# EAGLE schematic 4bitCounter (EAGLE 9.6.2)
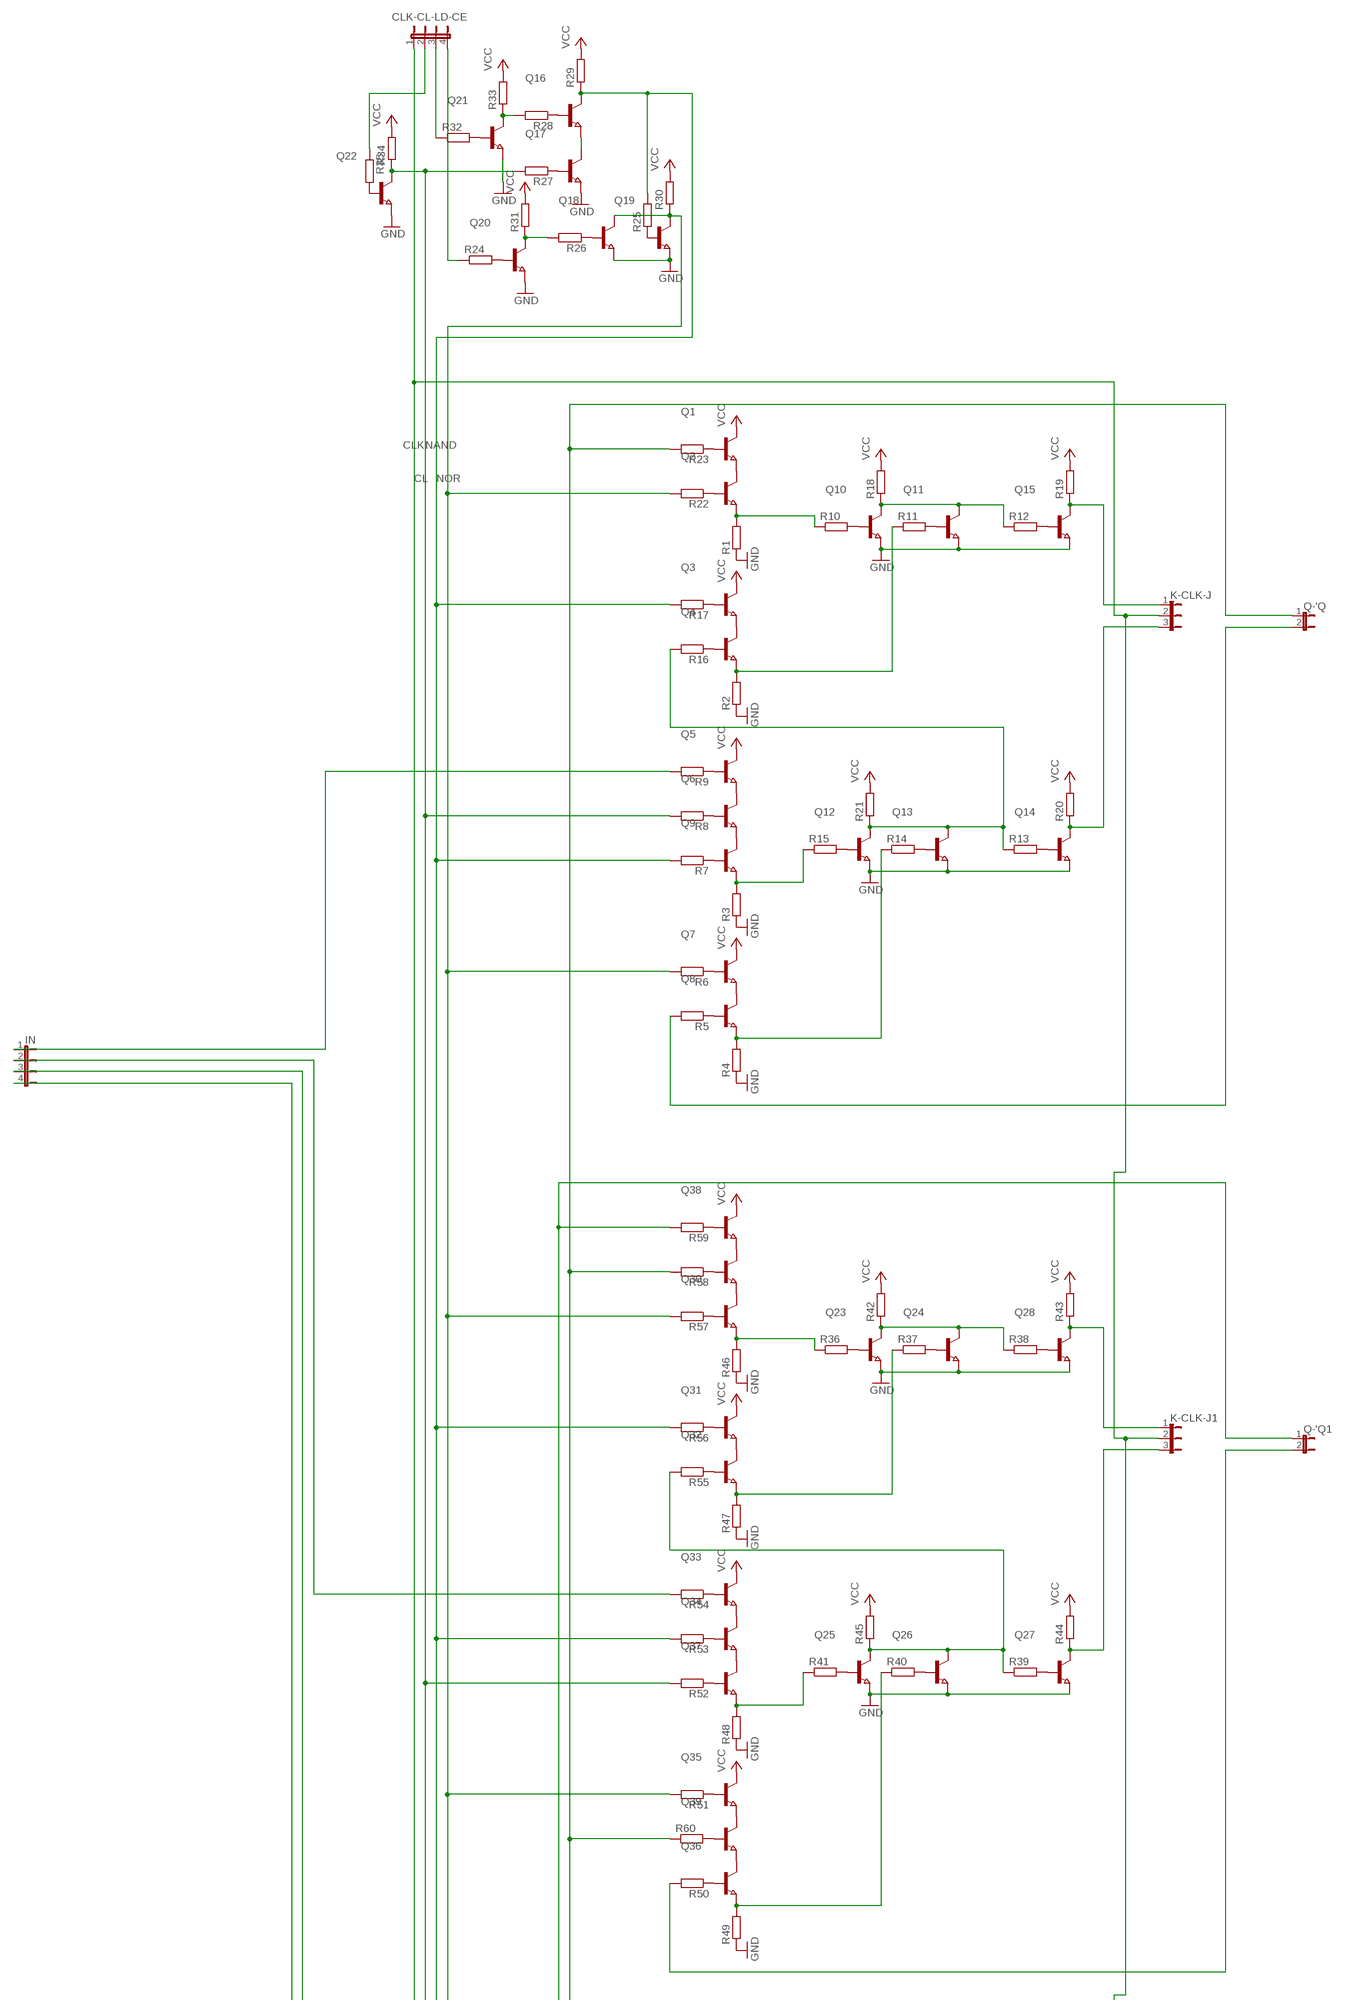
[diagram p0: schematic, sheet 1, part 1 of 2]
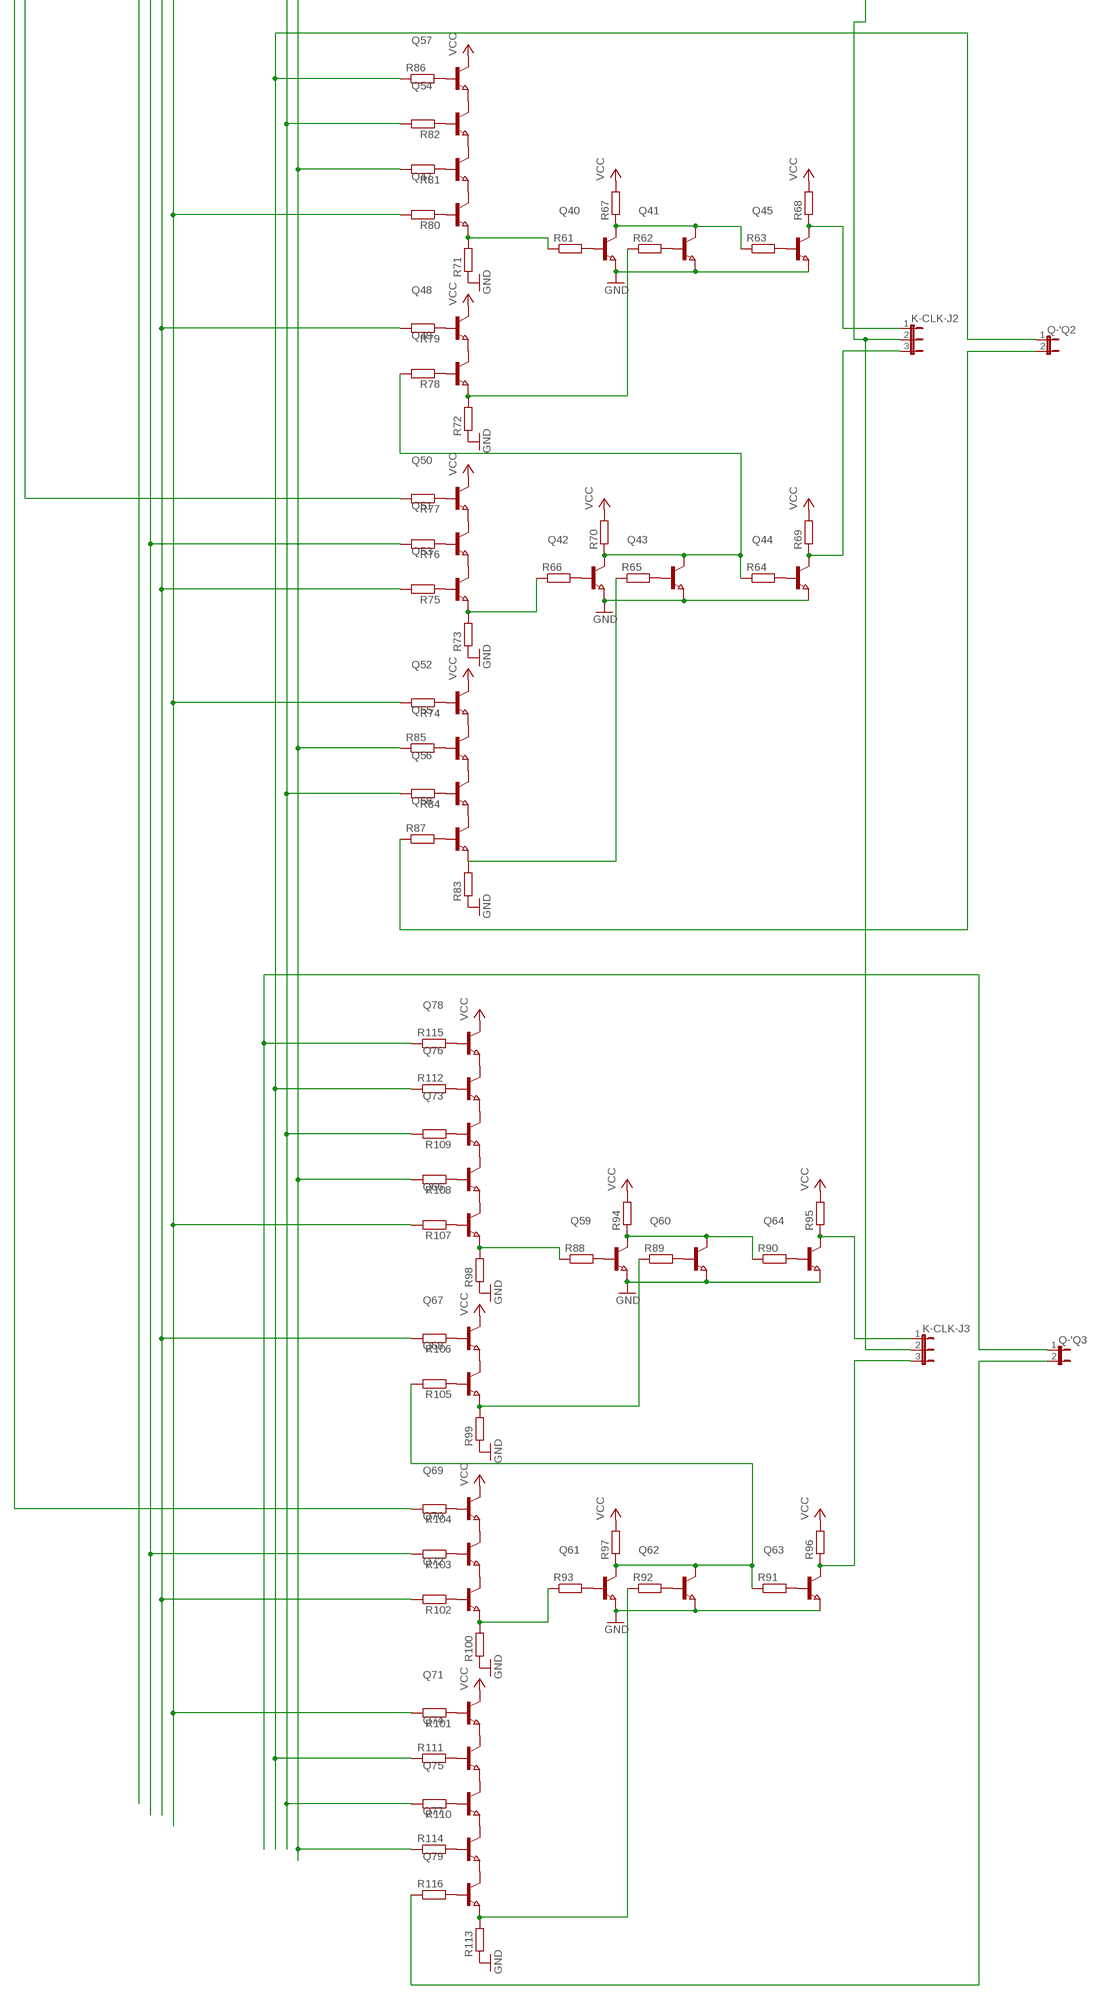
[diagram p1: schematic, sheet 1, part 2 of 2]

## Parts
CLK-CL-LD-CE  JP4E  [JP4]
IN  JP4E  [JP4]
K-CLK-J  JP2E  [JP2]
K-CLK-J1  JP2E  [JP2]
K-CLK-J2  JP2E  [JP2]
K-CLK-J3  JP2E  [JP2]
Q1  NPN-TRANSISTOR_SOT23  [SOT23]
Q2  NPN-TRANSISTOR_SOT23  [SOT23]
Q3  NPN-TRANSISTOR_SOT23  [SOT23]
Q4  NPN-TRANSISTOR_SOT23  [SOT23]
Q5  NPN-TRANSISTOR_SOT23  [SOT23]
Q6  NPN-TRANSISTOR_SOT23  [SOT23]
Q7  NPN-TRANSISTOR_SOT23  [SOT23]
Q8  NPN-TRANSISTOR_SOT23  [SOT23]
Q9  NPN-TRANSISTOR_SOT23  [SOT23]
Q10  NPN-TRANSISTOR_SOT23  [SOT23]
Q11  NPN-TRANSISTOR_SOT23  [SOT23]
Q12  NPN-TRANSISTOR_SOT23  [SOT23]
Q13  NPN-TRANSISTOR_SOT23  [SOT23]
Q14  NPN-TRANSISTOR_SOT23  [SOT23]
Q15  NPN-TRANSISTOR_SOT23  [SOT23]
Q16  NPN-TRANSISTOR_SOT23  [SOT23]
Q17  NPN-TRANSISTOR_SOT23  [SOT23]
Q18  NPN-TRANSISTOR_SOT23  [SOT23]
Q19  NPN-TRANSISTOR_SOT23  [SOT23]
Q20  NPN-TRANSISTOR_SOT23  [SOT23]
Q21  NPN-TRANSISTOR_SOT23  [SOT23]
Q22  NPN-TRANSISTOR_SOT23  [SOT23]
Q23  NPN-TRANSISTOR_SOT23  [SOT23]
Q24  NPN-TRANSISTOR_SOT23  [SOT23]
Q25  NPN-TRANSISTOR_SOT23  [SOT23]
Q26  NPN-TRANSISTOR_SOT23  [SOT23]
Q27  NPN-TRANSISTOR_SOT23  [SOT23]
Q28  NPN-TRANSISTOR_SOT23  [SOT23]
Q29  NPN-TRANSISTOR_SOT23  [SOT23]
Q30  NPN-TRANSISTOR_SOT23  [SOT23]
Q31  NPN-TRANSISTOR_SOT23  [SOT23]
Q32  NPN-TRANSISTOR_SOT23  [SOT23]
Q33  NPN-TRANSISTOR_SOT23  [SOT23]
Q34  NPN-TRANSISTOR_SOT23  [SOT23]
Q35  NPN-TRANSISTOR_SOT23  [SOT23]
Q36  NPN-TRANSISTOR_SOT23  [SOT23]
Q37  NPN-TRANSISTOR_SOT23  [SOT23]
Q38  NPN-TRANSISTOR_SOT23  [SOT23]
Q39  NPN-TRANSISTOR_SOT23  [SOT23]
Q40  NPN-TRANSISTOR_SOT23  [SOT23]
Q41  NPN-TRANSISTOR_SOT23  [SOT23]
Q42  NPN-TRANSISTOR_SOT23  [SOT23]
Q43  NPN-TRANSISTOR_SOT23  [SOT23]
Q44  NPN-TRANSISTOR_SOT23  [SOT23]
Q45  NPN-TRANSISTOR_SOT23  [SOT23]
Q46  NPN-TRANSISTOR_SOT23  [SOT23]
Q47  NPN-TRANSISTOR_SOT23  [SOT23]
Q48  NPN-TRANSISTOR_SOT23  [SOT23]
Q49  NPN-TRANSISTOR_SOT23  [SOT23]
Q50  NPN-TRANSISTOR_SOT23  [SOT23]
Q51  NPN-TRANSISTOR_SOT23  [SOT23]
Q52  NPN-TRANSISTOR_SOT23  [SOT23]
Q53  NPN-TRANSISTOR_SOT23  [SOT23]
Q54  NPN-TRANSISTOR_SOT23  [SOT23]
Q55  NPN-TRANSISTOR_SOT23  [SOT23]
Q56  NPN-TRANSISTOR_SOT23  [SOT23]
Q57  NPN-TRANSISTOR_SOT23  [SOT23]
Q58  NPN-TRANSISTOR_SOT23  [SOT23]
Q59  NPN-TRANSISTOR_SOT23  [SOT23]
Q60  NPN-TRANSISTOR_SOT23  [SOT23]
Q61  NPN-TRANSISTOR_SOT23  [SOT23]
Q62  NPN-TRANSISTOR_SOT23  [SOT23]
Q63  NPN-TRANSISTOR_SOT23  [SOT23]
Q64  NPN-TRANSISTOR_SOT23  [SOT23]
Q65  NPN-TRANSISTOR_SOT23  [SOT23]
Q66  NPN-TRANSISTOR_SOT23  [SOT23]
Q67  NPN-TRANSISTOR_SOT23  [SOT23]
Q68  NPN-TRANSISTOR_SOT23  [SOT23]
Q69  NPN-TRANSISTOR_SOT23  [SOT23]
Q70  NPN-TRANSISTOR_SOT23  [SOT23]
Q71  NPN-TRANSISTOR_SOT23  [SOT23]
Q72  NPN-TRANSISTOR_SOT23  [SOT23]
Q73  NPN-TRANSISTOR_SOT23  [SOT23]
Q74  NPN-TRANSISTOR_SOT23  [SOT23]
Q75  NPN-TRANSISTOR_SOT23  [SOT23]
Q76  NPN-TRANSISTOR_SOT23  [SOT23]
Q77  NPN-TRANSISTOR_SOT23  [SOT23]
Q78  NPN-TRANSISTOR_SOT23  [SOT23]
Q79  NPN-TRANSISTOR_SOT23  [SOT23]
Q-'Q  JP1E  [JP1]
Q-'Q1  JP1E  [JP1]
Q-'Q2  JP1E  [JP1]
Q-'Q3  JP1E  [JP1]
R1  R-EU_R1206  [R1206]
R2  R-EU_R1206  [R1206]
R3  R-EU_R1206  [R1206]
R4  R-EU_R1206  [R1206]
R5  R-EU_R1206  [R1206]
R6  R-EU_R1206  [R1206]
R7  R-EU_R1206  [R1206]
R8  R-EU_R1206  [R1206]
R9  R-EU_R1206  [R1206]
R10  R-EU_R1206  [R1206]
R11  R-EU_R1206  [R1206]
R12  R-EU_R1206  [R1206]
R13  R-EU_R1206  [R1206]
R14  R-EU_R1206  [R1206]
R15  R-EU_R1206  [R1206]
R16  R-EU_R1206  [R1206]
R17  R-EU_R1206  [R1206]
R18  R-EU_R1206  [R1206]
R19  R-EU_R1206  [R1206]
R20  R-EU_R1206  [R1206]
R21  R-EU_R1206  [R1206]
R22  R-EU_R1206  [R1206]
R23  R-EU_R1206  [R1206]
R24  R-EU_R1206  [R1206]
R25  R-EU_R1206  [R1206]
R26  R-EU_R1206  [R1206]
R27  R-EU_R1206  [R1206]
R28  R-EU_R1206  [R1206]
R29  R-EU_R1206  [R1206]
R30  R-EU_R1206  [R1206]
R31  R-EU_R1206  [R1206]
R32  R-EU_R1206  [R1206]
R33  R-EU_R1206  [R1206]
R34  R-EU_R1206  [R1206]
R35  R-EU_R1206  [R1206]
R36  R-EU_R1206  [R1206]
R37  R-EU_R1206  [R1206]
R38  R-EU_R1206  [R1206]
R39  R-EU_R1206  [R1206]
R40  R-EU_R1206  [R1206]
R41  R-EU_R1206  [R1206]
R42  R-EU_R1206  [R1206]
R43  R-EU_R1206  [R1206]
R44  R-EU_R1206  [R1206]
R45  R-EU_R1206  [R1206]
R46  R-EU_R1206  [R1206]
R47  R-EU_R1206  [R1206]
R48  R-EU_R1206  [R1206]
R49  R-EU_R1206  [R1206]
R50  R-EU_R1206  [R1206]
R51  R-EU_R1206  [R1206]
R52  R-EU_R1206  [R1206]
R53  R-EU_R1206  [R1206]
R54  R-EU_R1206  [R1206]
R55  R-EU_R1206  [R1206]
R56  R-EU_R1206  [R1206]
R57  R-EU_R1206  [R1206]
R58  R-EU_R1206  [R1206]
R59  R-EU_R1206  [R1206]
R60  R-EU_R1206  [R1206]
R61  R-EU_R1206  [R1206]
R62  R-EU_R1206  [R1206]
R63  R-EU_R1206  [R1206]
R64  R-EU_R1206  [R1206]
R65  R-EU_R1206  [R1206]
R66  R-EU_R1206  [R1206]
R67  R-EU_R1206  [R1206]
R68  R-EU_R1206  [R1206]
R69  R-EU_R1206  [R1206]
R70  R-EU_R1206  [R1206]
R71  R-EU_R1206  [R1206]
R72  R-EU_R1206  [R1206]
R73  R-EU_R1206  [R1206]
R74  R-EU_R1206  [R1206]
R75  R-EU_R1206  [R1206]
R76  R-EU_R1206  [R1206]
R77  R-EU_R1206  [R1206]
R78  R-EU_R1206  [R1206]
R79  R-EU_R1206  [R1206]
R80  R-EU_R1206  [R1206]
R81  R-EU_R1206  [R1206]
R82  R-EU_R1206  [R1206]
R83  R-EU_R1206  [R1206]
R84  R-EU_R1206  [R1206]
R85  R-EU_R1206  [R1206]
R86  R-EU_R1206  [R1206]
R87  R-EU_R1206  [R1206]
R88  R-EU_R1206  [R1206]
R89  R-EU_R1206  [R1206]
R90  R-EU_R1206  [R1206]
R91  R-EU_R1206  [R1206]
R92  R-EU_R1206  [R1206]
R93  R-EU_R1206  [R1206]
R94  R-EU_R1206  [R1206]
R95  R-EU_R1206  [R1206]
R96  R-EU_R1206  [R1206]
R97  R-EU_R1206  [R1206]
R98  R-EU_R1206  [R1206]
R99  R-EU_R1206  [R1206]
R100  R-EU_R1206  [R1206]
R101  R-EU_R1206  [R1206]
R102  R-EU_R1206  [R1206]
R103  R-EU_R1206  [R1206]
R104  R-EU_R1206  [R1206]
R105  R-EU_R1206  [R1206]
R106  R-EU_R1206  [R1206]
R107  R-EU_R1206  [R1206]
R108  R-EU_R1206  [R1206]
R109  R-EU_R1206  [R1206]
R110  R-EU_R1206  [R1206]
R111  R-EU_R1206  [R1206]
R112  R-EU_R1206  [R1206]
R113  R-EU_R1206  [R1206]
R114  R-EU_R1206  [R1206]
R115  R-EU_R1206  [R1206]
R116  R-EU_R1206  [R1206]

## Nets
CL: Q22.3(C) R8.2 R27.2 R34.1 R52.2 R76.2 R103.2
CLK: CLK-CL-LD-CE.1 K-CLK-J1.2 K-CLK-J2.2 K-CLK-J3.2 K-CLK-J.2
GND: Q10.2(E) Q11.2(E) Q12.2(E) Q13.2(E) Q14.2(E) Q15.2(E) Q17.2(E) Q18.2(E) Q19.2(E) Q20.2(E) Q21.2(E) Q22.2(E) Q23.2(E) Q24.2(E) Q25.2(E) Q26.2(E) Q27.2(E) Q28.2(E) Q40.2(E) Q41.2(E) Q42.2(E) Q43.2(E) Q44.2(E) Q45.2(E) Q59.2(E) Q60.2(E) Q61.2(E) Q62.2(E) Q63.2(E) Q64.2(E) R1.1 R2.1 R3.1 R4.1 R46.1 R47.1 R48.1 R49.1 R71.1 R72.1 R73.1 R83.1 R98.1 R99.1 R100.1 R113.1
N$1: Q1.2(E) Q2.3(C)
N$2: Q3.2(E) Q4.3(C)
N$3: Q5.2(E) Q6.3(C)
N$4: Q7.2(E) Q8.3(C)
N$5: Q6.2(E) Q9.3(C)
N$6: Q2.2(E) R1.2 R10.1
N$7: Q4.2(E) R2.2 R11.1
N$8: Q9.2(E) R3.2 R15.1
N$9: Q8.2(E) R4.2 R14.1
N$10: Q8.1(B) R5.1
N$11: Q7.1(B) R6.1
N$12: Q9.1(B) R7.1
N$13: Q6.1(B) R8.1
N$14: Q5.1(B) R9.1
N$15: Q10.1(B) R10.2
N$16: Q11.1(B) R11.2
N$17: Q15.1(B) R12.2
N$18: Q14.1(B) R13.2
N$19: Q13.1(B) R14.2
N$20: Q12.1(B) R15.2
N$21: Q4.1(B) R16.1
N$22: Q3.1(B) R17.1
N$23: Q10.3(C) Q11.3(C) R12.1 R18.1
N$24: K-CLK-J.1 Q15.3(C) R19.1
N$25: K-CLK-J.3 Q14.3(C) R20.1
N$26: Q12.3(C) Q13.3(C) R13.1 R16.2 R21.1
N$27: Q2.1(B) R22.1
N$28: Q1.1(B) R23.1
N$29: IN.1 R9.2
N$30: Q16.2(E) Q17.3(C)
N$31: Q20.1(B) R24.2
N$32: Q19.1(B) R25.1
N$33: Q18.1(B) R26.1
N$34: Q17.1(B) R27.1
N$35: Q16.1(B) R28.1
N$36: Q-'Q.2 R5.2
N$37: Q23.1(B) R36.2
N$38: Q20.3(C) R26.2 R31.1
N$39: CLK-CL-LD-CE.4 R24.1
N$40: Q21.1(B) R32.2
N$41: Q21.3(C) R28.2 R33.1
N$42: CLK-CL-LD-CE.3 R32.1
N$43: Q22.1(B) R35.2
N$44: CLK-CL-LD-CE.2 R35.1
N$45: Q-'Q.1 R23.2 R58.2 R60.1 R81.2 R85.1 R108.2 R114.1
N$46: Q24.1(B) R37.2
N$47: Q28.1(B) R38.2
N$48: Q27.1(B) R39.2
N$49: Q26.1(B) R40.2
N$50: Q25.1(B) R41.2
N$51: Q23.3(C) Q24.3(C) R38.1 R42.1
N$52: K-CLK-J1.1 Q28.3(C) R43.1
N$53: K-CLK-J1.3 Q27.3(C) R44.1
N$54: Q25.3(C) Q26.3(C) R39.1 R45.1 R55.2
N$55: Q29.2(E) Q30.3(C)
N$56: Q31.2(E) Q32.3(C)
N$57: Q33.2(E) Q34.3(C)
N$58: IN.2 R54.2
N$59: Q34.2(E) Q37.3(C)
N$60: Q30.2(E) R36.1 R46.2
N$61: Q32.2(E) R37.1 R47.2
N$62: Q37.2(E) R41.1 R48.2
N$63: Q36.2(E) R40.1 R49.2
N$64: Q36.1(B) R50.1
N$65: Q35.1(B) R51.1
N$66: Q37.1(B) R52.1
N$67: Q34.1(B) R53.1
N$68: Q33.1(B) R54.1
N$69: Q32.1(B) R55.1
N$70: Q31.1(B) R56.1
N$71: Q30.1(B) R57.1
N$72: Q29.1(B) R58.1
N$73: Q40.1(B) R61.2
N$74: Q-'Q1.2 R50.2
N$75: Q41.1(B) R62.2
N$76: Q45.1(B) R63.2
N$77: Q-'Q1.1 R59.2 R82.2 R84.2 R109.2 R110.2
N$78: Q29.3(C) Q38.2(E)
N$79: Q38.1(B) R59.1
N$80: Q35.2(E) Q39.3(C)
N$81: Q36.3(C) Q39.2(E)
N$82: Q39.1(B) R60.2
N$83: Q44.1(B) R64.2
N$84: Q43.1(B) R65.2
N$85: Q42.1(B) R66.2
N$86: Q40.3(C) Q41.3(C) R63.1 R67.1
N$87: K-CLK-J2.1 Q45.3(C) R68.1
N$88: K-CLK-J2.3 Q44.3(C) R69.1
N$89: Q42.3(C) Q43.3(C) R64.1 R70.1 R78.2
N$90: Q46.2(E) Q47.3(C)
N$91: Q48.2(E) Q49.3(C)
N$92: Q50.2(E) Q51.3(C)
N$93: Q51.2(E) Q53.3(C)
N$94: Q47.2(E) R61.1 R71.2
N$95: Q49.2(E) R62.1 R72.2
N$96: Q53.2(E) R66.1 R73.2
N$97: Q59.1(B) R88.2
N$98: Q52.1(B) R74.1
N$99: Q53.1(B) R75.1
N$100: Q51.1(B) R76.1
N$101: Q50.1(B) R77.1
N$102: Q49.1(B) R78.1
N$103: Q48.1(B) R79.1
N$104: Q47.1(B) R80.1
N$105: Q46.1(B) R81.1
N$106: Q60.1(B) R89.2
N$107: Q-'Q2.1 R86.1 R111.1 R112.1
N$108: Q46.3(C) Q54.2(E)
N$109: Q54.1(B) R82.1
N$110: Q52.2(E) Q55.3(C)
N$111: Q56.1(B) R84.1
N$112: Q55.2(E) Q56.3(C)
N$113: Q55.1(B) R85.2
N$114: Q54.3(C) Q57.2(E)
N$115: Q57.1(B) R86.2
N$116: Q-'Q2.2 R87.1
N$117: Q58.2(E) R83.2
N$118: Q56.2(E) Q58.3(C)
N$119: R65.1
N$120: Q58.1(B) R87.2
N$121: IN.3 R77.2
N$122: Q64.1(B) R90.2
N$123: Q63.1(B) R91.2
N$124: Q62.1(B) R92.2
N$125: Q61.1(B) R93.2
N$126: Q59.3(C) Q60.3(C) R90.1 R94.1
N$127: K-CLK-J3.1 Q64.3(C) R95.1
N$128: K-CLK-J3.3 Q63.3(C) R96.1
N$129: Q61.3(C) Q62.3(C) R91.1 R97.1 R105.2
N$130: Q65.2(E) Q66.3(C)
N$131: Q67.2(E) Q68.3(C)
N$132: Q69.2(E) Q70.3(C)
N$133: Q70.2(E) Q72.3(C)
N$134: Q66.2(E) R88.1 R98.2
N$135: Q68.2(E) R89.1 R99.2
N$136: Q72.2(E) R93.1 R100.2
N$137: Q71.1(B) R101.1
N$138: Q72.1(B) R102.1
N$139: Q70.1(B) R103.1
N$140: Q69.1(B) R104.1
N$141: Q68.1(B) R105.1
N$142: Q67.1(B) R106.1
N$143: Q66.1(B) R107.1
N$144: Q65.1(B) R108.1
N$145: Q-'Q3.1 R115.1
N$146: Q65.3(C) Q73.2(E)
N$147: Q73.1(B) R109.1
N$148: Q71.2(E) Q74.3(C)
N$149: Q75.1(B) R110.1
N$150: Q74.2(E) Q75.3(C)
N$151: Q74.1(B) R111.2
N$152: Q73.3(C) Q76.2(E)
N$153: Q76.1(B) R112.2
N$154: Q-'Q3.2 R116.1
N$155: Q79.2(E) R113.2
N$156: Q75.2(E) Q77.3(C)
N$157: IN.4 R104.2
N$158: Q77.1(B) R114.2
N$159: Q76.3(C) Q78.2(E)
N$160: Q78.1(B) R115.2
N$161: R92.1
N$162: Q77.2(E) Q79.3(C)
N$163: Q79.1(B) R116.2
NAND: Q16.3(C) R7.2 R17.2 R25.2 R29.1 R53.2 R56.2 R75.2 R79.2 R102.2 R106.2
NOR: Q18.3(C) Q19.3(C) R6.2 R22.2 R30.1 R51.2 R57.2 R74.2 R80.2 R101.2 R107.2
VCC: Q1.3(C) Q3.3(C) Q5.3(C) Q7.3(C) Q31.3(C) Q33.3(C) Q35.3(C) Q38.3(C) Q48.3(C) Q50.3(C) Q52.3(C) Q57.3(C) Q67.3(C) Q69.3(C) Q71.3(C) Q78.3(C) R18.2 R19.2 R20.2 R21.2 R29.2 R30.2 R31.2 R33.2 R34.2 R42.2 R43.2 R44.2 R45.2 R67.2 R68.2 R69.2 R70.2 R94.2 R95.2 R96.2 R97.2

## Library data of the parts
CLK-CL-LD-CE IN = jumper:JP4E: JUMPER
K-CLK-J K-CLK-J1-K-CLK-J3 = jumper:JP2E: JUMPER
Q1-Q79 = semicon-smd-ipc:NPN-TRANSISTOR_: NPN TRANSISTOR
Q-'Q Q-'Q1-Q-'Q3 = jumper:JP1E: JUMPER
R1-R116 = rcl:R-EU_: RESISTOR, European symbol; SPICEPREFIX: R

## Module 4BITCOUNTFRAG
Ports: 

### Library data of the parts